# Altium schematic sheet Sheet2.SchDoc
size A4; SheetNumber: 1; SheetTotal: 1
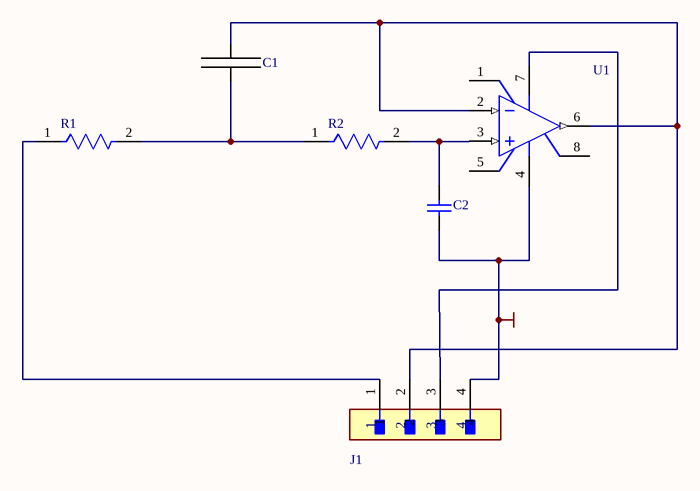
[diagram p0: Sheet2.SchDoc]

## Parts
C1  Cap_0805  [C_0805]  (value not drawn)
C2  06035A160JAT2A  [CAPC1608X90X35ML15T15]  (value not drawn)
J1  DF3A-4P-2DSA  [FP-DF3A-4P-2DSA-MFG]  (value not drawn)
R1  RG1005P-393-B-T5  [FP-RG1005-IPC_B]  (value not drawn)
R2  RG1005P-393-B-T5  [FP-RG1005-IPC_B]  (value not drawn)
U1  LM741H  [LMC0008A]  (value not drawn)

## Nets
NetC2_1: C2.1 J1.4 U1.4(V-)
NetC1_1: C1.1 R1.2 R2.1
NetC1_2: C1.2 J1.2 U1.2(IN-) U1.6(OUT)
NetC2_2: C2.2 R2.2 U1.3(IN+)
NetJ1_1: J1.1 R1.1
NetJ1_3: J1.3 U1.7(V+)

Not connected (* = marked no-connect by the designer): U1 1(OFS_NULL) 5(OFS_NULL) 8(NC)

## Library data of the parts
C2 = CMP-2006-04247-1: Manufacturer: AVX Interconnect / Elco; Part Number: 06035A160JAT2A
J1 = CMP-11610-000039-1: CONN HEADER VERT 4POS 2MM; Gender: Male; Voltage Rating: 250V; Current Rating: 3A; Number of Positions: 4; Insulation Resistance: 1GR; Connector Type: Male Pin; Contact Plating: Tin; Termination: Through Hole; Number of Rows: 1; Pitch: 2mm; Length: 10mm; Radiation Hardening: No; Insulation Material: Nylon; Contact Gender: Male; Housing Color: Black; Orientation: Straight; Contact Material: Brass; Lead Free: Lead Free; Housing Material: Polyamide; Mount: Through Hole; Color: Black; Packaging: Bulk; Height: 5mm; Package Quantity: 100; Contact Type: Male Pin; RoHS Compliant: Yes; Number of Contacts: 4; Series: DF3
R1 R2 = CMP-2002-01450-2: Automotive Metal Thin Film Chip Resistor, 0402, 39kΩ, 0.1%, 25ppm/°C, 0.0625W, 75V; Voltage Rating (DC): 25V; Max Power Dissipation: 63mW; Resistance: 39kR; Number of Terminations: 2; Case/Package: 0402; Temperature Coefficient: 25ppm/°C; Number of Pins: 2; Packaging: Tape and Reel; Weight: 2.3E-05oz; Length: 1mm; Size Code: 0402; Resistance Tolerance: 0.1%; Case Code (Imperial): 0402; Min Operating Temperature: -55°C; Series: RG; RoHS Compliant: Yes; Resistor Type: Thin Film; Height: 0.35mm; Features: Automotive AEC-Q200; Lead Free: Lead Free; Width: 0.5mm; Tolerance: 0.1%; Termination: SMD/SMT; Max Operating Temperature: 155°C; Power Rating: 63mW; Case Code (Metric): 1005; Voltage Rating: 75V
U1 = CMP-0055-00031-3: Operational Amplifier, 8-pin TO-99; Manufacturer: Texas Instruments; PackageTopMarking: NSZXYTTE# LM741H; CompType: Amplifiers; PowerWise: N; ComponentLink1Description: Datasheet URL; PinCount: 8; ComponentLink1URL: http://www.ti.com/general/docs/lit/getliterature.tsp?genericPartNumber=LM741&fileType=pdf; Package Reference: LMC0008A; RoHS: N; PackageDescription: Metal Can, TO-99, 8 Lead, .200 Dia., P.C.; Code_JEDEC: TO-99